# Altium schematic sheet adc-breakout.SchDoc: Simple ADC breakout [Master]
size A4; DocumentNumber: 1; SheetNumber: 1; SheetTotal: 1
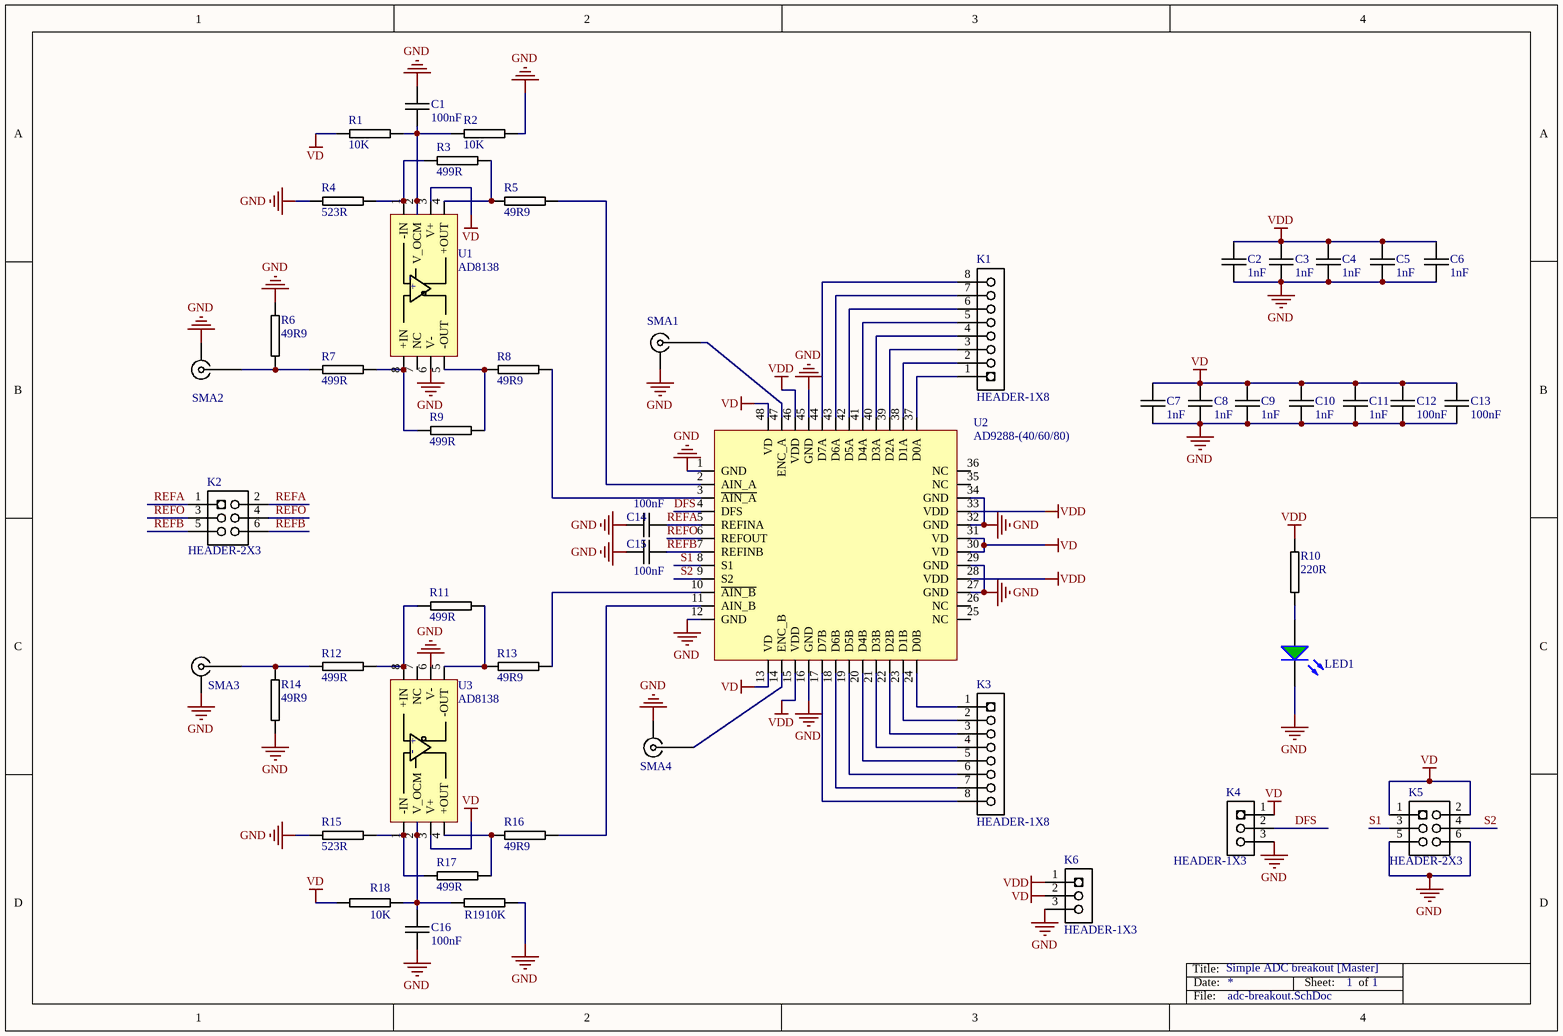
[diagram p0: adc-breakout.SchDoc]

## Parts
C1  100nF  [0603C-GENERIC]
C2  1nF  [0603C-GENERIC]
C3  1nF  [0603C-GENERIC]
C4  1nF  [0603C-GENERIC]
C5  1nF  [0603C-GENERIC]
C6  1nF  [0603C-GENERIC]
C7  1nF  [0603C-GENERIC]
C8  1nF  [0603C-GENERIC]
C9  1nF  [0603C-GENERIC]
C10  1nF  [0603C-GENERIC]
C11  1nF  [0603C-GENERIC]
C12  100nF  [0603C-GENERIC]
C13  100nF  [0603C-GENERIC]
C14  100nF  [0603C-GENERIC]
C15  100nF  [0603C-GENERIC]
C16  100nF  [0603C-GENERIC]
K1  HEADER-1X8  [HEADER-1X8]
K2  HEADER-2X3  [HEADER-2X3]
K3  HEADER-1X8  [HEADER-1X8]
K4  HEADER-1X3  [HEADER-1X3]
K5  HEADER-2X3  [HEADER-2X3]
K6  HEADER-1X3  [HEADER-1X3]
LED1  Green  [0805LED - GREEN]  (value not drawn)
R1  10K  [0603R-10K]
R2  10K  [0603R-10K]
R3  499R  [0603R-GENERIC]
R4  523R  [0603R-GENERIC]
R5  49R9  [0603R-GENERIC]
R6  49R9  [0603R-GENERIC]
R7  499R  [0603R-GENERIC]
R8  49R9  [0603R-GENERIC]
R9  499R  [0603R-GENERIC]
R10  220R  [0603R-220]
R11  499R  [0603R-GENERIC]
R12  499R  [0603R-GENERIC]
R13  49R9  [0603R-GENERIC]
R14  49R9  [0603R-GENERIC]
R15  523R  [0603R-GENERIC]
R16  49R9  [0603R-GENERIC]
R17  499R  [0603R-GENERIC]
R18  10K  [0603R-10K]
R19  10K  [0603R-10K]
SMA1  *  [MOLEX_SMA_EDGE]  (value not drawn)
SMA2  *  [MOLEX_SMA_EDGE]  (value not drawn)
SMA3  *  [MOLEX_SMA_EDGE]  (value not drawn)
SMA4  *  [MOLEX_SMA_EDGE]  (value not drawn)
U1  AD8138  [AD8138-SOIC8]
U2  AD9288-(40/60/80)  [ad9288-48QFP]
U3  AD8138  [AD8138-SOIC8]

## Nets
GND: C1.2 C2.1 C3.1 C4.1 C5.1 C6.1 C7.1 C8.1 C9.1 C10.1 C11.1 C12.2 C13.2 C14.1 C15.1 C16.2 K4.3 K5.5 K5.6 K6.3 LED1.K R2.2 R4.1 R6.2 R14.2 R15.1 R19.2 SMA1.2 SMA2.2 SMA3.2 SMA4.2 U1.6(V-) U2.1(GND) U2.12(GND) U2.16(GND) U2.27(GND) U2.29(GND) U2.32(GND) U2.34(GND) U2.45(GND) U3.6(V-)
VD: C7.2 C8.2 C9.2 C10.2 C11.2 C12.1 C13.1 K4.1 K5.1 K5.2 K6.2 R1.1 R18.1 U1.3(V+) U2.13(VD) U2.30(VD) U2.31(VD) U2.48(VD) U3.3(V+)
VDD: C2.2 C3.2 C4.2 C5.2 C6.2 K6.1 R10.1 U2.15(VDD) U2.28(VDD) U2.33(VDD) U2.46(VDD)
DFS: K4.2 U2.4(DFS)
REFA: C14.2 K2.1 K2.2 U2.5(REFINA)
REFB: C15.2 K2.5 K2.6 U2.7(REFINB)
REFO: K2.3 K2.4 U2.6(REFOUT)
S1: K5.3 U2.8(S1)
S2: K5.4 U2.9(S2)
NetC1_1: C1.1 R1.2 R2.1 U1.2(V_OCM)
NetC16_1: C16.1 R18.2 R19.1 U3.2(V_OCM)
NetK1_1: K1.1 U2.37(D0A)
NetK1_2: K1.2 U2.38(D1A)
NetK1_3: K1.3 U2.39(D2A)
NetK1_4: K1.4 U2.40(D3A)
NetK1_5: K1.5 U2.41(D4A)
NetK1_6: K1.6 U2.42(D5A)
NetK1_7: K1.7 U2.43(D6A)
NetK1_8: K1.8 U2.44(D7A)
NetK3_1: K3.1 U2.24(D0B)
NetK3_2: K3.2 U2.23(D1B)
NetK3_3: K3.3 U2.22(D2B)
NetK3_4: K3.4 U2.21(D3B)
NetK3_5: K3.5 U2.20(D4B)
NetK3_6: K3.6 U2.19(D5B)
NetK3_7: K3.7 U2.18(D6B)
NetK3_8: K3.8 U2.17(D7B)
NetLED1_A: LED1.A R10.2
NetR3_1: R3.1 R4.2 U1.1(-IN)
NetR3_2: R3.2 R5.1 U1.4(+OUT)
NetR5_2: R5.2 U2.2(AIN_A)
NetR6_1: R6.1 R7.1 SMA2.1
NetR7_2: R7.2 R9.1 U1.8(+IN)
NetR8_1: R8.1 R9.2 U1.5(-OUT)
NetR8_2: R8.2 U2.3(~{AIN_A})
NetR11_1: R11.1 R12.2 U3.8(+IN)
NetR11_2: R11.2 R13.1 U3.5(-OUT)
NetR12_1: R12.1 R14.1 SMA3.1
NetR13_2: R13.2 U2.10(~{AIN_B})
NetR15_2: R15.2 R17.1 U3.1(-IN)
NetR16_1: R16.1 R17.2 U3.4(+OUT)
NetR16_2: R16.2 U2.11(AIN_B)
NetSMA1_1: SMA1.1 U2.47(ENC_A)
NetSMA4_1: SMA4.1 U2.14(ENC_B)

Not connected (* = marked no-connect by the designer): U1 7(NC); U2 25(NC) 26(NC) 35(NC) 36(NC); U3 7(NC)

## Notes on the sheet
- Title:
- Date:
- Sheet:
- of
- File:
- (in symbol AD8138) +; -

## Library data of the parts
C1 C12-C16 = 0603C-100NF-25V-X7R-TDK: CAPACITOR 0603 CERAMIC; Manufacturer Part Number: C1608X7R1E104K; Manufacturer: TDK Corporation; Reel: C12; Supplier 1: Digi-Key; Supplier Part Number 1: 445-1316-2-ND
C2-C11 = 0603C-1NF-50V-X7R: CAPACITOR 0603 CERAMIC
LED1 = 0805 SMD LED - GREEN: Supplier 1: Digi-Key; Supplier Part Number 1: 160-1426-1-ND
R1 R2 R18 R19 = 0603R-10K: GENERIC RESISTOR 0603; Manufacturer: Stackpole Electronics Inc; Manufacturer Part Number: RMCF 1/16 10K 1% R; Tolerance: ±1%; Power (Watts): 0.1W, 1/10W; Temperature Coefficient: ±100ppm/°C; Resistance In Ohms: 10.0K; Reel: R21; Category: Resistors; Supplier Part Number: RMCF1/1610KFRDKR-ND; Lead Style: Surface Mount (SMD - SMT); RoHS: RoHS Compliant; Packaging: Digi-Reel®; Case: 0603 (1608 metric); Composition: Thick Film; Supplier: Digi-Key; Supplier 1: Digi-Key; Supplier Part Number 1: RMCF0603FT10K0DKR-ND
R3 R4 R7 R9 R11 R12 R15 R17 = 0603R-499R: GENERIC RESISTOR 0603; Supplier 1: Digi-Key; Supplier Part Number 1: RNCP0603FTD499RTR-ND
R5 R6 R8 R13 R14 R16 = 0603R-49R9: GENERIC RESISTOR 0603; Supplier 1: Digi-Key; Supplier Part Number 1: RMCF0603FT49R9TR-ND
R10 = 0603R-220: GENERIC RESISTOR 0603; Manufacturer: Stackpole Electronics Inc; Manufacturer Part Number: RMCF 1/16 220 1% R; Resistance In Ohms: 220; Power (Watts): 0.1W, 1/10W; Tolerance: ±1%; Temperature Coefficient: ±100ppm/°C; Supplier 1: Digi-Key; Supplier Part Number 1: RMCF1/16220FRCT-ND; Lead Style: Surface Mount (SMD - SMT); Case: 0603 (1608 metric); RoHS: RoHS Compliant; Supplier: Digi-Key; Packaging: Cut Tape (CT); Composition: Thick Film; Supplier Part Number: RMCF1/16220FRCT-ND; Category: Resistors
SMA1-SMA4 = MOLEX_SMA_EDGE: Supplier 1: Digi-Key; Supplier Part Number 1: WM5534-ND
U2 = AD9288: Supplier 1: Digi-Key; Supplier Part Number 1: AD9288BSTZ-40-ND
K1 K3 = HEADER-1X8: Supplier 1: Digi-Key; Supplier Part Number 1: S1011E-36-ND
K2 K5 = HEADER-2X3: Supplier 1: Digi-Key; Supplier Part Number 1: OR1081-ND
K4 K6 = HEADER-1X3: Supplier 1: Digi-Key; Supplier Part Number 1: S1011E-36-ND
U1 U3 = AD8138: Supplier 1: Digi-Key; Supplier Part Number 1: AD8138ARZ-R7CT-ND